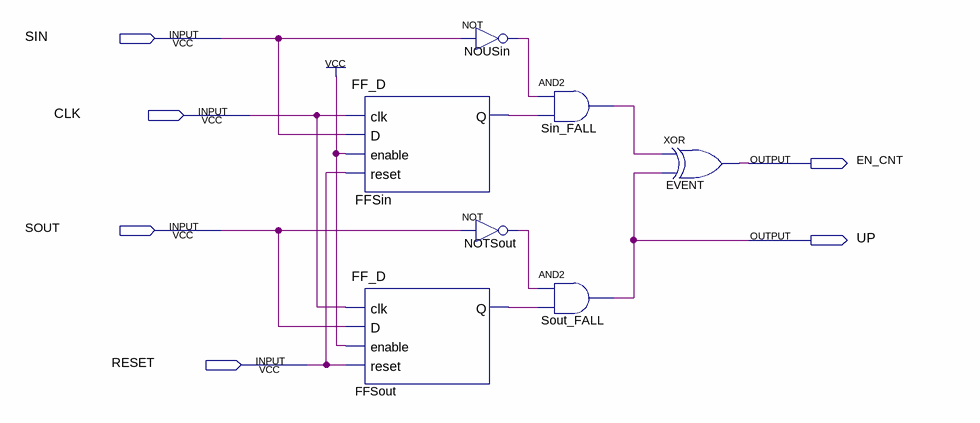
[diagram p0: schematic sheet]
// Quartus schematic Trata_Ent.bdf as structural Verilog: 7 symbols, 6 pins
module Trata_Ent (
  input  SIN,
  input  CLK,
  input  SOUT,
  input  RESET,
  output EN_CNT,
  output UP
);

  wire FFSin_q, FFSout_q, NOTSout_out, NOUSin_out, Sin_FALL_out;

  FF_D FFSin (.clk(CLK), .D(SIN), .enable(1'b1), .reset(RESET), .Q(FFSin_q));
  FF_D FFSout (.clk(CLK), .D(SOUT), .enable(1'b1), .reset(RESET), .Q(FFSout_q));
  not NOUSin (NOUSin_out, SIN);
  not NOTSout (NOTSout_out, SOUT);
  and Sin_FALL (Sin_FALL_out, NOUSin_out, FFSin_q);
  and Sout_FALL (UP, NOTSout_out, FFSout_q);
  xor EVENT (EN_CNT, Sin_FALL_out, UP);
endmodule
